# Altium project BMS_Slave.PrjPCB
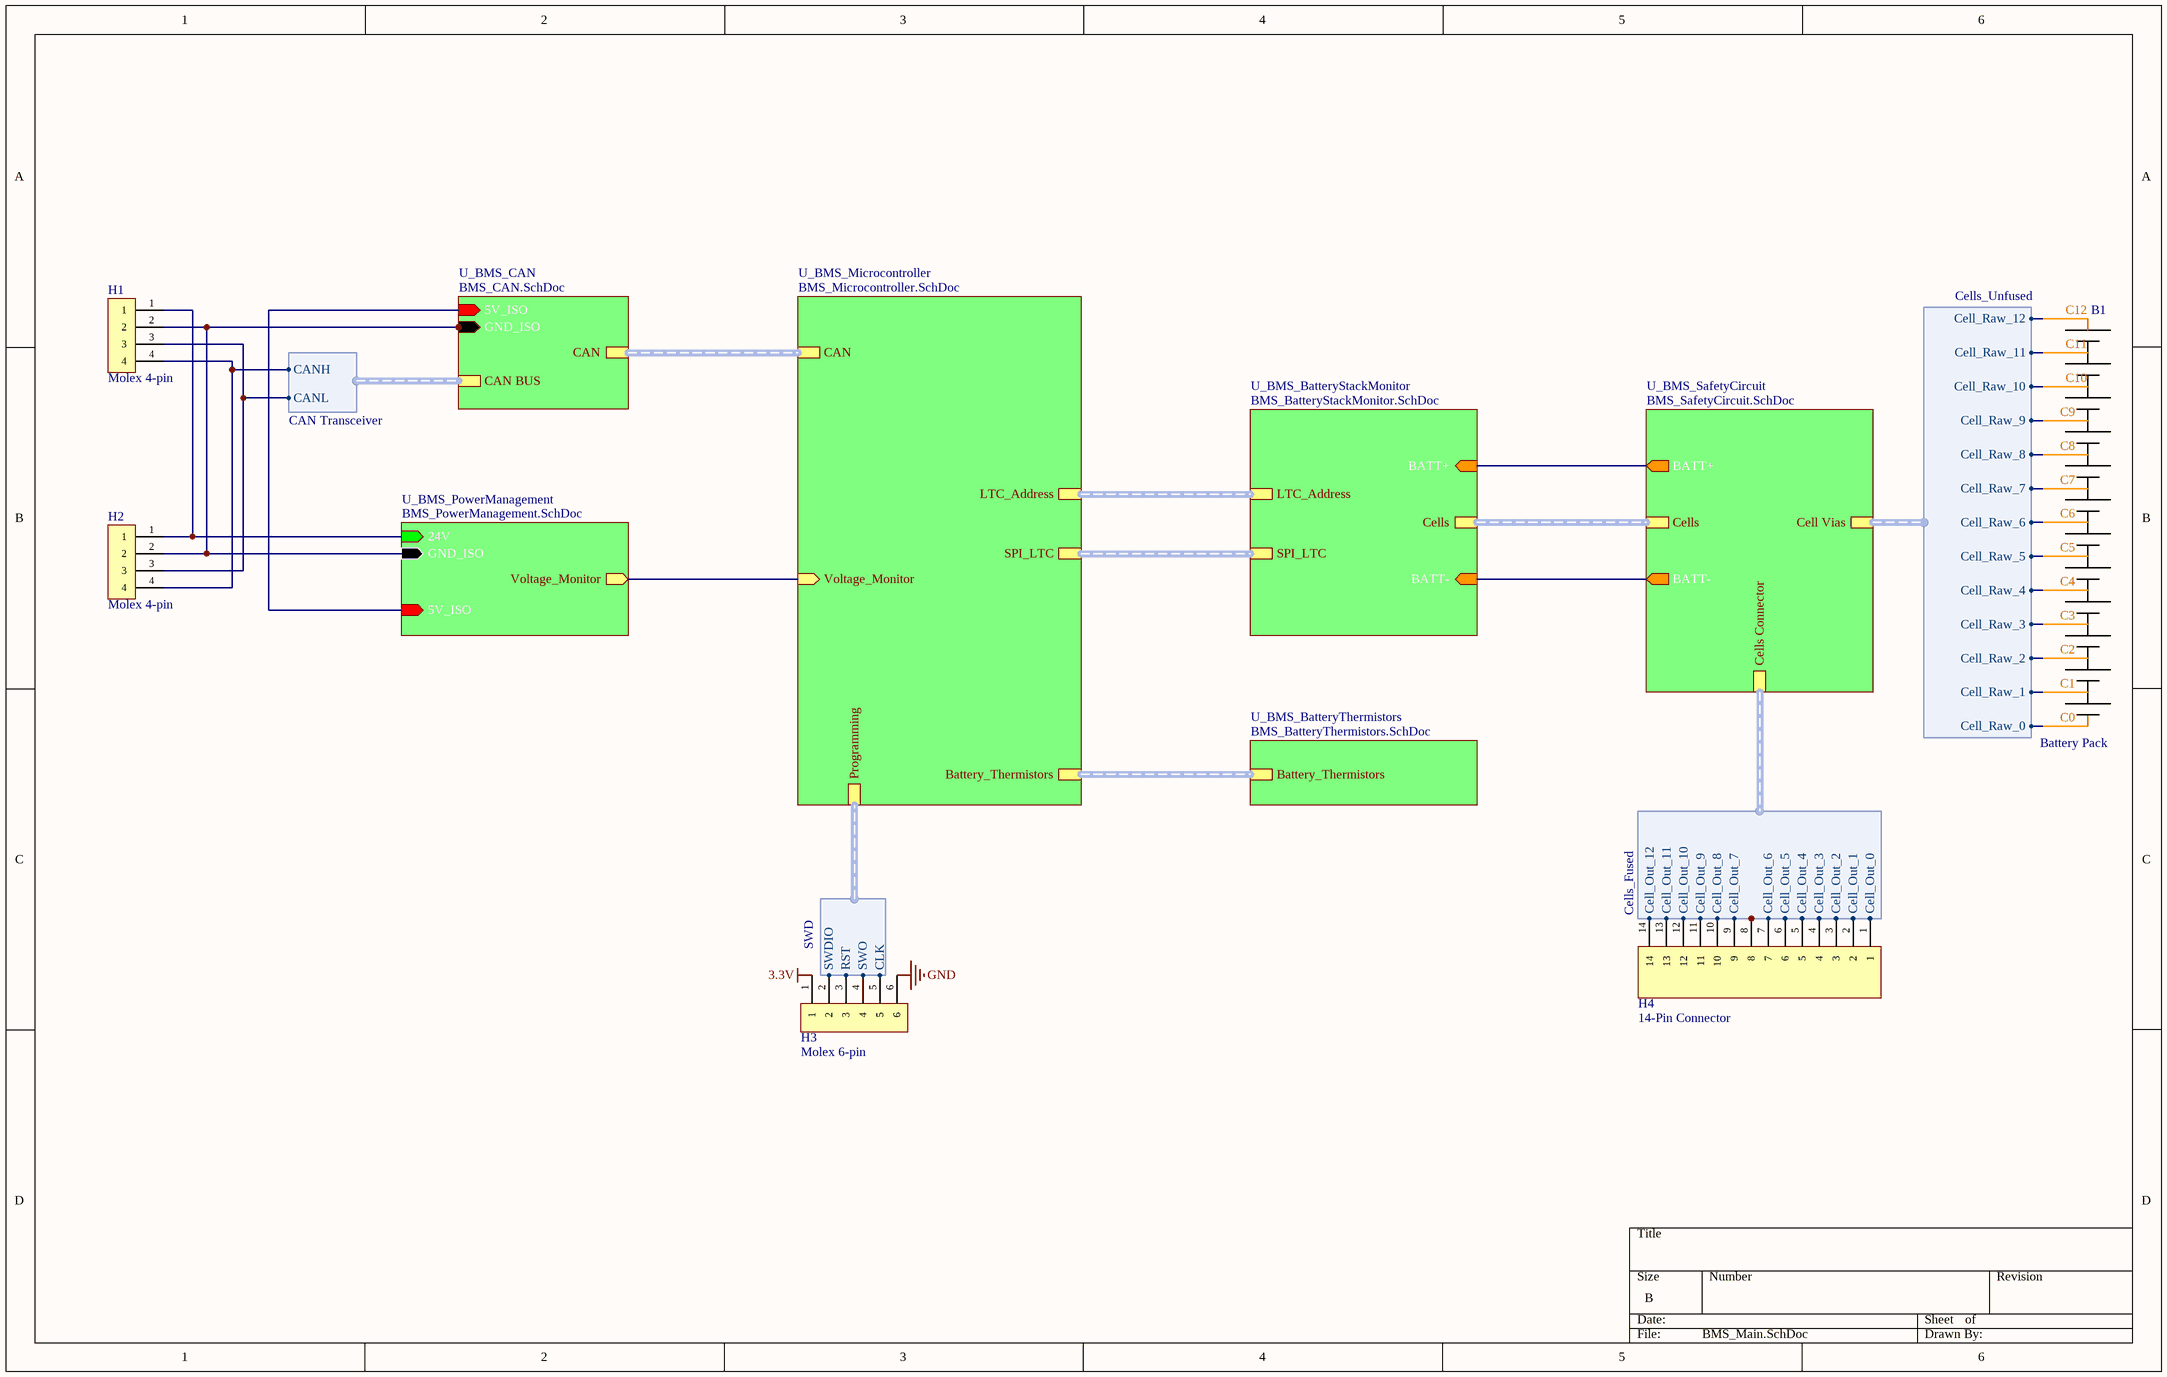
[diagram p0: BMS_Main.SchDoc]
8 sheets, 270 parts. Net scope: hierarchical (ports join the sheet entries above them; power ports are global).
Board file: Slave.PcbDoc
Sheets:
  BMS_Main.SchDoc
    U_BMS_BatteryStackMonitor = BMS_BatteryStackMonitor.SchDoc
      CELL1 = BMS_CellCircuit.SchDoc
      CELL2 = BMS_CellCircuit.SchDoc
      CELL3 = BMS_CellCircuit.SchDoc
      CELL4 = BMS_CellCircuit.SchDoc
      CELL5 = BMS_CellCircuit.SchDoc
      CELL6 = BMS_CellCircuit.SchDoc
      CELL7 = BMS_CellCircuit.SchDoc
      CELL8 = BMS_CellCircuit.SchDoc
      CELL9 = BMS_CellCircuit.SchDoc
      CELL10 = BMS_CellCircuit.SchDoc
      CELL11 = BMS_CellCircuit.SchDoc
      CELL12 = BMS_CellCircuit.SchDoc
    U_BMS_BatteryThermistors = BMS_BatteryThermistors.SchDoc
    U_BMS_Microcontroller = BMS_Microcontroller.SchDoc
    U_BMS_SafetyCircuit = BMS_SafetyCircuit.SchDoc
    U_BMS_CAN = BMS_CAN.SchDoc
    U_BMS_PowerManagement = BMS_PowerManagement.SchDoc

## Sheet BMS_Main.SchDoc
size B

### Parts
B1  Battery Pack  [Cells]
H1  Molex 4-pin  [Communication Connector]
H2  Molex 4-pin  [Communication Connector]
H3  Molex 6-pin  [ProgrammingConnector]
H4  14-Pin Connector  [CellConnector]

### Sub-sheets
U_BMS_BatteryStackMonitor = BMS_BatteryStackMonitor.SchDoc: Cells (harness Harness), BATT+ (in), SPI_LTC (harness SPI), BATT- (in), LTC_Address (harness Address)
U_BMS_BatteryThermistors = BMS_BatteryThermistors.SchDoc: Battery_Thermistors (harness Thermistors)
U_BMS_CAN = BMS_CAN.SchDoc: CAN (harness CAN Controller), CAN BUS (harness CAN Transceiver), GND_ISO (in), 5V_ISO (in)
U_BMS_Microcontroller = BMS_Microcontroller.SchDoc: CAN (harness CAN), Programming (harness SWD), SPI_LTC (harness SPI), Battery_Thermistors (harness Thermistors), LTC_Address (harness Address), Voltage_Monitor (in)
U_BMS_PowerManagement = BMS_PowerManagement.SchDoc: GND_ISO (in), Voltage_Monitor (out), 5V_ISO (in), 24V (in)
U_BMS_SafetyCircuit = BMS_SafetyCircuit.SchDoc: Cell Vias (harness Cells_Unfused), Cells Connector (harness Cells_Fused), Cells (harness Cells Switches), BATT+ (out), BATT- (out)

### Harnesses
CAN Transceiver: CANL, CANH
Cells_Unfused: Cell_Raw_0, Cell_Raw_1, Cell_Raw_2, Cell_Raw_3, Cell_Raw_4, Cell_Raw_5, Cell_Raw_6, Cell_Raw_7, Cell_Raw_8, Cell_Raw_9, Cell_Raw_10, Cell_Raw_11, Cell_Raw_12
Cells_Fused: Cell_Out_0, Cell_Out_1, Cell_Out_2, Cell_Out_3, Cell_Out_4, Cell_Out_5, Cell_Out_6, Cell_Out_7, Cell_Out_8, Cell_Out_9, Cell_Out_10, Cell_Out_11, Cell_Out_12
SWD: SWDIO, SWO, CLK, RST

### Nets
3.3V: H3.1
5V_ISO: sheet U_BMS_CAN/5V_ISO, sheet U_BMS_PowerManagement/5V_ISO
BATT+: sheet U_BMS_BatteryStackMonitor/BATT+, sheet U_BMS_SafetyCircuit/BATT+
GND: H3.6
GND_ISO: H1.2 H2.2 ; sheet U_BMS_CAN/GND_ISO, sheet U_BMS_PowerManagement/GND_ISO
24V: H1.1 H2.1 ; sheet U_BMS_PowerManagement/24V
CF0: H4.1 ; sheet U_BMS_SafetyCircuit/Cells Connector.Cell_Out_0
CF1: H4.2 ; sheet U_BMS_SafetyCircuit/Cells Connector.Cell_Out_1
CF2: H4.3 ; sheet U_BMS_SafetyCircuit/Cells Connector.Cell_Out_2
CF3: H4.4 ; sheet U_BMS_SafetyCircuit/Cells Connector.Cell_Out_3
CF4: H4.5 ; sheet U_BMS_SafetyCircuit/Cells Connector.Cell_Out_4
CF5: H4.6 ; sheet U_BMS_SafetyCircuit/Cells Connector.Cell_Out_5
CF6: H4.7 H4.8 ; sheet U_BMS_SafetyCircuit/Cells Connector.Cell_Out_6
CF7: H4.9 ; sheet U_BMS_SafetyCircuit/Cells Connector.Cell_Out_7
CF8: H4.10 ; sheet U_BMS_SafetyCircuit/Cells Connector.Cell_Out_8
CF9: H4.11 ; sheet U_BMS_SafetyCircuit/Cells Connector.Cell_Out_9
CF10: H4.12 ; sheet U_BMS_SafetyCircuit/Cells Connector.Cell_Out_10
CF11: H4.13 ; sheet U_BMS_SafetyCircuit/Cells Connector.Cell_Out_11
CF12: H4.14 ; sheet U_BMS_SafetyCircuit/Cells Connector.Cell_Out_12
CN1: sheet U_BMS_BatteryStackMonitor/BATT-, sheet U_BMS_SafetyCircuit/BATT-
RESET: H3.3 ; sheet U_BMS_Microcontroller/Programming.RST
SWCLK: H3.5 ; sheet U_BMS_Microcontroller/Programming.CLK
SWDIO: H3.2 ; sheet U_BMS_Microcontroller/Programming.SWDIO
SWO: H3.4 ; sheet U_BMS_Microcontroller/Programming.SWO
Voltage_Monitor: sheet U_BMS_Microcontroller/Voltage_Monitor, sheet U_BMS_PowerManagement/Voltage_Monitor
NetB1_0: B1.0 ; sheet U_BMS_SafetyCircuit/Cell Vias.Cell_Raw_0
NetB1_1: B1.1 ; sheet U_BMS_SafetyCircuit/Cell Vias.Cell_Raw_1
NetB1_2: B1.2 ; sheet U_BMS_SafetyCircuit/Cell Vias.Cell_Raw_2
NetB1_3: B1.3 ; sheet U_BMS_SafetyCircuit/Cell Vias.Cell_Raw_3
NetB1_4: B1.4 ; sheet U_BMS_SafetyCircuit/Cell Vias.Cell_Raw_4
NetB1_5: B1.5 ; sheet U_BMS_SafetyCircuit/Cell Vias.Cell_Raw_5
NetB1_6: B1.6 ; sheet U_BMS_SafetyCircuit/Cell Vias.Cell_Raw_6
NetB1_7: B1.7 ; sheet U_BMS_SafetyCircuit/Cell Vias.Cell_Raw_7
NetB1_8: B1.8 ; sheet U_BMS_SafetyCircuit/Cell Vias.Cell_Raw_8
NetB1_9: B1.9 ; sheet U_BMS_SafetyCircuit/Cell Vias.Cell_Raw_9
NetB1_10: B1.10 ; sheet U_BMS_SafetyCircuit/Cell Vias.Cell_Raw_10
NetB1_11: B1.11 ; sheet U_BMS_SafetyCircuit/Cell Vias.Cell_Raw_11
NetB1_12: B1.12 ; sheet U_BMS_SafetyCircuit/Cell Vias.Cell_Raw_12
NetChoke500_2: H1.4 H2.4 ; sheet U_BMS_CAN/CAN BUS.CANH
NetChoke500_3: H1.3 H2.3 ; sheet U_BMS_CAN/CAN BUS.CANL

### Buses and harness runs
harness sheet U_BMS_BatteryStackMonitor/Cells = sheet U_BMS_SafetyCircuit/Cells
harness sheet U_BMS_BatteryStackMonitor/LTC_Address = sheet U_BMS_Microcontroller/LTC_Address
harness sheet U_BMS_BatteryStackMonitor/SPI_LTC = sheet U_BMS_Microcontroller/SPI_LTC
harness sheet U_BMS_BatteryThermistors/Battery_Thermistors = sheet U_BMS_Microcontroller/Battery_Thermistors
harness sheet U_BMS_CAN/CAN = sheet U_BMS_Microcontroller/CAN

### Notes on the sheet
- (in symbol Battery Pack) C12; C11; C10; C9; C8; C7; C6; C5; C4; C3; C2; C1; C0

### Library data of the parts
B1 = Battery Pack: 12s3p battery pack, LiFePO4 GH Battery Cell with 3.7V and 8Ah
H1 H2 = Molex 4-pin: Micro-Fit 3.0 Vertical Header, 3.00mm Pitch, Dual Row, 4 Circuits, with Solder Tab, Tin, Glow-Wire Capable, Black + Micro-Fit 3.0 Receptacle Housing, Dual Row, 4 Circuits, UL 94V-0, Low-Halogen, Black
H3 = Molex 6-pin: Micro-Fit 3.0 Vertical Header, 3.00mm Pitch, Dual Row, 6 Circuits, with Solder Tab, Tin, Glow-Wire Capable, Black + Micro-Fit 3.0 Receptacle Housing, Dual Row, 6 Circuits, UL 94V-0, Low-Halogen, Black
H4 = 14-Pin Connector: Micro-Fit 3.0 Right-Angle Header, 3.00mm Pitch, Dual Row, 14 Circuits, with Solder Tab, Tin, Glow-Wire Capable, Black + Micro-Fit 3.0 Receptacle Housing, Dual Row, 14 Circuits, UL 94V-0, Low-Halogen, Black

## Sheet BMS_BatteryStackMonitor.SchDoc
size A
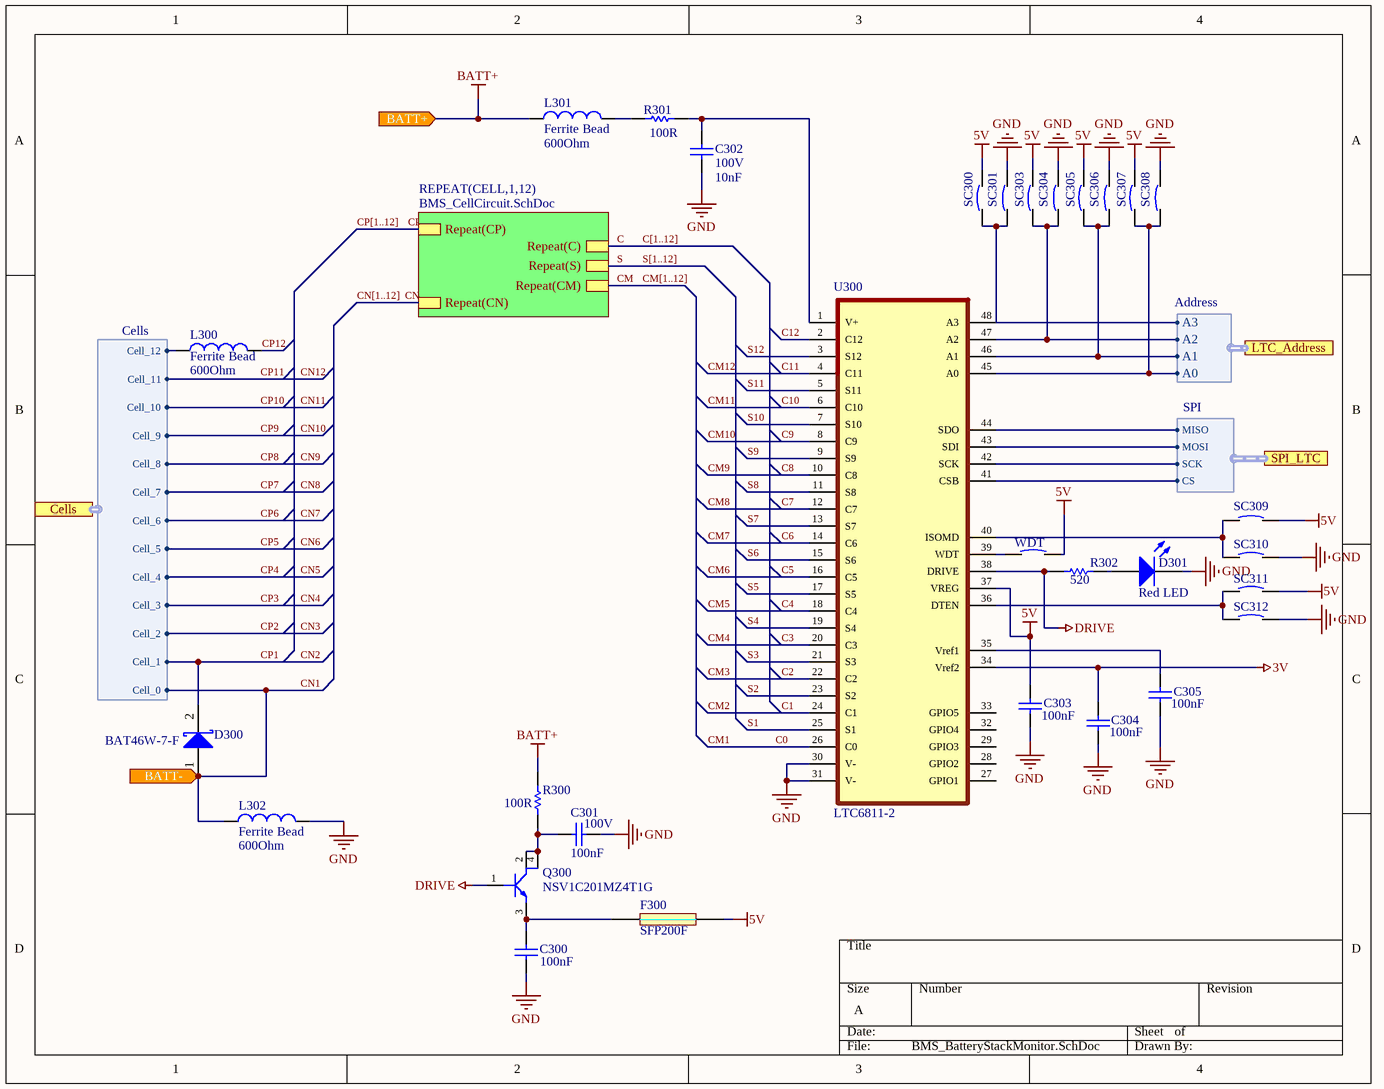
[diagram p1: BMS_BatteryStackMonitor.SchDoc]

### Parts
C300  value 100nF  [CAPC2012X14N]  (hidden comment: 100V)
C301  100V  value 100nF  [CAPC2012X14N]
C302  100V  value 10nF  [CAPC2012X14N]
C303  value 100nF  [CAPC2012X14N]  (hidden comment: 100V)
C304  value 100nF  [CAPC2012X14N]  (hidden comment: 100V)
C305  value 100nF  [CAPC2012X14N]  (hidden comment: 100V)
D300  BAT46W-7-F  [SODFL370X135-2N]
D301  Red LED  [SMD RED LED]
F300  SFP200F  [DIOC3216X12N]
L300  Ferrite Bead  value 600Ohm  [INDC3216X13N]
L301  Ferrite Bead  value 600Ohm  [INDC3216X13N]
L302  Ferrite Bead  value 600Ohm  [INDC3216X13N]
Q300  NSV1C201MZ4T1G  [SOT230P700X180-4N]
R300  value 100R  [RESC2012X07N]  (hidden comment: R0805)
R301  value 100R  [RESC2012X07N]  (hidden comment: R0805)
R302  value 520  [RESC2012X07N]  (hidden comment: R0805)
SC300  Short Circuit  [RESC2012X07N]  (value not drawn)
SC301  Short Circuit  [RESC2012X07N]  (value not drawn)
SC303  Short Circuit  [RESC2012X07N]  (value not drawn)
SC304  Short Circuit  [RESC2012X07N]  (value not drawn)
SC305  Short Circuit  [RESC2012X07N]  (value not drawn)
SC306  Short Circuit  [RESC2012X07N]  (value not drawn)
SC307  Short Circuit  [RESC2012X07N]  (value not drawn)
SC308  Short Circuit  [RESC2012X07N]  (value not drawn)
SC309  Short Circuit  [RESC2012X07N]  (value not drawn)
SC310  Short Circuit  [RESC2012X07N]  (value not drawn)
SC311  Short Circuit  [RESC2012X07N]  (value not drawn)
SC312  Short Circuit  [RESC2012X07N]  (value not drawn)
U300  LTC6811-2  [SSOP50P780X200-48N]
WDT  Short Circuit  [RESC2012X07N]  (value not drawn)

### Sub-sheets
REPEAT(CELL,1,12) = BMS_CellCircuit.SchDoc: Repeat(CP), Repeat(CN), Repeat(C), Repeat(CM), Repeat(S)

### Ports
BATT+ (in), BATT- (in), Cells (harness Cells), LTC_Address (harness Address), SPI_LTC (harness SPI)

### Harnesses
Cells: Cell_0, Cell_1, Cell_2, Cell_3, Cell_4, Cell_5, Cell_6, Cell_7, Cell_8, Cell_9, Cell_10, Cell_11, Cell_12
SPI: MISO, MOSI, SCK, CS
Address: A3, A2, A1, A0

### Nets
3V: C304.1 U300.34(Vref2)
5V: C303.1 F300.2 SC300.2 SC303.2 SC305.2 SC307.2 SC309.2 SC311.2 U300.37(VREG) WDT.2
BATT+: L300.1 L301.1 R300.1 ; port BATT+, port Cells.Cell_12
DRIVE: Q300.1 R302.2 U300.38(DRIVE)
GND: C300.2 C301.2 C302.2 C303.2 C304.2 C305.2 D301.2(K) L302.2 SC301.2 SC304.2 SC306.2 SC308.2 SC310.2 SC312.2 U300.30(V-) U300.31(V-)
C: sheet REPEAT(CELL,1,12)/Repeat(C)
C0: U300.26(C0)  [also labelled CM1]
C1: U300.24(C1)  [also labelled CM2]
C2: U300.22(C2)  [also labelled CM3]
C3: U300.20(C3)  [also labelled CM4]
C4: U300.18(C4)  [also labelled CM5]
C5: U300.16(C5)  [also labelled CM6]
C6: U300.14(C6)  [also labelled CM7]
C7: U300.12(C7)  [also labelled CM8]
C8: U300.10(C8)  [also labelled CM9]
C9: U300.8(C9)  [also labelled CM10]
C10: U300.6(C10)  [also labelled CM11]
C11: U300.4(C11)  [also labelled CM12]
C12: U300.2(C12)
CM: sheet REPEAT(CELL,1,12)/Repeat(CM)
CN: sheet REPEAT(CELL,1,12)/Repeat(CN)
CN1: D300.1(A) L302.1 ; port BATT-, port Cells.Cell_0
CN2: D300.2(K) ; port Cells.Cell_1  [also labelled CP1]
CP: sheet REPEAT(CELL,1,12)/Repeat(CP)
CP12: L300.2
S: sheet REPEAT(CELL,1,12)/Repeat(S)
S1: U300.25(S1)
S2: U300.23(S2)
S3: U300.21(S3)
S4: U300.19(S4)
S5: U300.17(S5)
S6: U300.15(S6)
S7: U300.13(S7)
S8: U300.11(S8)
S9: U300.9(S9)
S10: U300.7(S10)
S11: U300.5(S11)
S12: U300.3(S12)
SPI1_CS: U300.41(CSB) ; port SPI_LTC.CS
SPI1_MISO: U300.44(SDO) ; port SPI_LTC.MISO
SPI1_MOSI: U300.43(SDI) ; port SPI_LTC.MOSI
SPI1_SCK: U300.42(SCK) ; port SPI_LTC.SCK
Α0: SC307.1 SC308.1 U300.45(A0) ; port LTC_Address.A0
Α1: SC305.1 SC306.1 U300.46(A1) ; port LTC_Address.A1
Α2: SC303.1 SC304.1 U300.47(A2) ; port LTC_Address.A2
Α3: SC300.1 SC301.1 U300.48(A3) ; port LTC_Address.A3
NetC300_1: C300.1 F300.1 Q300.3
NetC301_1: C301.1 Q300.2 Q300.4 R300.2
NetC302_1: C302.1 R301.1 U300.1(V+)
NetC305_1: C305.1 U300.35(Vref1)
NetD301_1: D301.1(A) R302.1
NetL301_2: L301.2 R301.2
NetSC309_1: SC309.1 SC310.1 U300.40(ISOMD)
NetSC311_1: SC311.1 SC312.1 U300.36(DTEN)
NetU300_39: U300.39(WDT) WDT.1

Not connected (* = marked no-connect by the designer): U300 27(GPIO1) 28(GPIO2) 29(GPIO3) 32(GPIO4) 33(GPIO5)

### Buses and harness runs
bus C[1..12]
bus CM[1..12]
bus CN[1..12]
bus CP[1..12]
bus S[1..12]

### Library data of the parts
C300-C305 = Cap: Capacitor; Published: 8-Jun-2000; LatestRevisionDate: 17-Jul-2002; LatestRevisionNote: Re-released for DXP Platform.; PackageReference: RAD-0.3; Publisher: Altium Limited; PackageDescription: Radial Cap, Thru-Hole; 2 Leads; 0.3 in Pin Spacing
D300 = Diode BAT17: Silicon RF Schottky Diode for Mixer Applications in the VHF/UHF Range; Note: Pin 2 is not connected and not drawn.; Published: 21-Mar-2003; LatestRevisionDate: 29-May-2009; LatestRevisionNote: IPC-7351 Footprint Added.; DatasheetVersion: Oct-1999; PackageVersion: Sep-2001; PackageReference: SOT-23; Publisher: Altium Limited; PackageDescription: 3-Pin SOT-23 Package 0.95 mm Pitch, 2.5 mm Lead Span; ComponentLink1Description: Manufacturer Link; ComponentLink1URL: http://www.infineon.com/; ComponentLink2Description: Datasheet; ComponentLink2URL: http://www.infineon.com/upload/Document/cmc_upload/documents/009/363/bat17series.pdf
D301 = LED0: Typical INFRARED GaAs LED; Published: 8-Jun-2000; LatestRevisionDate: 08-Jul-2005; LatestRevisionNote: Mech Layer 1 removed.; PackageReference: LED-0; Publisher: Altium Limited; PackageDescription: LED; 2 Leads
F300 = SFP200F: Surface Mount Fuses VERY FAST GLASS CER 63V 2A SZ 1206
L300 L302 = Inductor: Code_IEC: 1005; Published: 8-Jun-2000; LatestRevisionDate: 29-May-2009; LatestRevisionNote: IPC-7351 Footprint Added.; PackageReference: 0402-A; Publisher: Altium Limited; PackageDescription: Chip Inductor; Code_JEITA: 0402
L301 = Inductor: Inductor Coil - Ferrite Bead; Code_IEC: 1005; Published: 8-Jun-2000; LatestRevisionDate: 29-May-2009; LatestRevisionNote: IPC-7351 Footprint Added.; PackageReference: 0402-A; Publisher: Altium Limited; PackageDescription: Chip Inductor; Code_JEITA: 0402
Q300 = NSV1C201MZ4T1G: 100V, 2.0A, LOW Vce(sat), NPN Transistor
R300-R302 = Res1: Resistor; Published: 8-Jun-2000; LatestRevisionDate: 17-Jul-2002; LatestRevisionNote: Re-released for DXP Platform.; PackageReference: AXIAL-0.3; Publisher: Altium Limited; PackageDescription: Axial Device, Thru-Hole; 2 Leads; 0.3 in Pin Spacing
U300 = LTC6811-2: LTC6811-2, Multicell Battery Monitor, 48-Lead SSOP Package

## Sheet BMS_CellCircuit.SchDoc
size A
Used 12 times, as channels U_BMS_BatteryStackMonitor/CELL1, U_BMS_BatteryStackMonitor/CELL2, U_BMS_BatteryStackMonitor/CELL3, U_BMS_BatteryStackMonitor/CELL4, U_BMS_BatteryStackMonitor/CELL5, U_BMS_BatteryStackMonitor/CELL6, U_BMS_BatteryStackMonitor/CELL7, U_BMS_BatteryStackMonitor/CELL8, U_BMS_BatteryStackMonitor/CELL9, U_BMS_BatteryStackMonitor/CELL10, U_BMS_BatteryStackMonitor/CELL11, U_BMS_BatteryStackMonitor/CELL12. Parts and nets are listed once, with the designators drawn on the sheet.
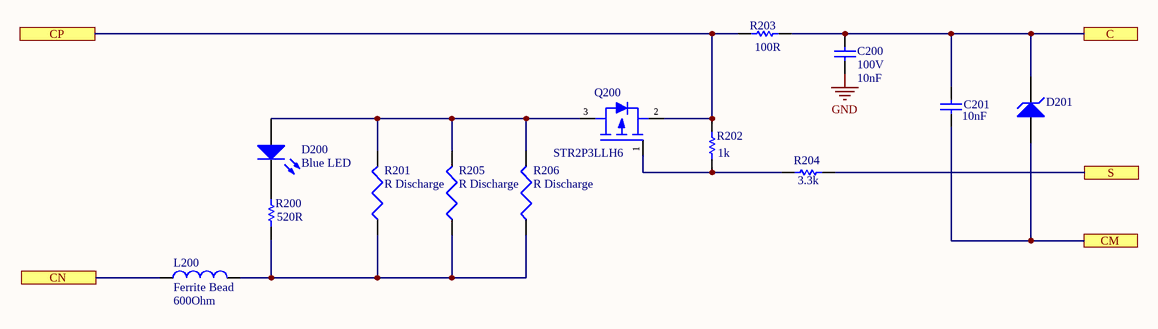
[diagram p2: BMS_CellCircuit.SchDoc]

### Parts
C200  100V  value 10nF  [CAPC2012X14N]
C201  value 10nF  [CAPC2012X14N]  (hidden comment: C0805)
D200  Blue LED  [SMD Blue LED]
D201  D Zener 6.8V  [SODFL250X110-2N]  (value not drawn)
L200  Ferrite Bead  value 600Ohm  [INDC3216X13N]
Q200  STR2P3LLH6  [SOT95P280X110-3N]
R200  value 520R  [RESC2012X07N]  (hidden comment: R0805)
R201  R Discharge  [RESC1632X06N]
R202  value 1k  [RESC2012X07N]  (hidden comment: R0805)
R203  value 100R  [RESC2012X07N]  (hidden comment: R0805)
R204  value 3.3k  [RESC2012X07N]  (hidden comment: R0805)
R205  R Discharge  [RESC1632X06N]
R206  R Discharge  [RESC1632X06N]

### Ports
C, CM, CN, CP, S

### Nets
GND: C200.2
C: C200.1 C201.1 D201.2(K) R203.1 ; port C
CM: C201.2 D201.1(A) ; port CM
CN: L200.1 ; port CN
CP: Q200.2 R202.2 R203.2 ; port CP
S: R204.1 ; port S
NetD200_1: D200.1(A) Q200.3 R201.2 R205.2 R206.2
NetD200_2: D200.2(K) R200.2
NetL200_2: L200.2 R200.1 R201.1 R205.1 R206.1
NetQ200_1: Q200.1 R202.1 R204.2

### Channels
U_BMS_BatteryStackMonitor/CELL1: designators end in _CELL1; ports C=C1 CM=C0 CN=CN1 CP=CN2 S=S1
U_BMS_BatteryStackMonitor/CELL2: designators end in _CELL2; ports C=C2 CM=C1 CN=CN2 CP=CN3 S=S2
U_BMS_BatteryStackMonitor/CELL3: designators end in _CELL3; ports C=C3 CM=C2 CN=CN3 CP=CN4 S=S3
U_BMS_BatteryStackMonitor/CELL4: designators end in _CELL4; ports C=C4 CM=C3 CN=CN4 CP=CN5 S=S4
U_BMS_BatteryStackMonitor/CELL5: designators end in _CELL5; ports C=C5 CM=C4 CN=CN5 CP=CN6 S=S5
U_BMS_BatteryStackMonitor/CELL6: designators end in _CELL6; ports C=C6 CM=C5 CN=CN6 CP=CN7 S=S6
U_BMS_BatteryStackMonitor/CELL7: designators end in _CELL7; ports C=C7 CM=C6 CN=CN7 CP=CN8 S=S7
U_BMS_BatteryStackMonitor/CELL8: designators end in _CELL8; ports C=C8 CM=C7 CN=CN8 CP=CN9 S=S8
U_BMS_BatteryStackMonitor/CELL9: designators end in _CELL9; ports C=C9 CM=C8 CN=CN9 CP=CN10 S=S9
U_BMS_BatteryStackMonitor/CELL10: designators end in _CELL10; ports C=C10 CM=C9 CN=CN10 CP=CN11 S=S10
U_BMS_BatteryStackMonitor/CELL11: designators end in _CELL11; ports C=C11 CM=C10 CN=CN11 CP=CN12 S=S11
U_BMS_BatteryStackMonitor/CELL12: designators end in _CELL12; ports C=C12 CM=C11 CN=CN12 CP=CP12 S=S12

### Library data of the parts
C200 C201 = Cap: Capacitor; Published: 8-Jun-2000; LatestRevisionDate: 17-Jul-2002; LatestRevisionNote: Re-released for DXP Platform.; PackageReference: RAD-0.3; Publisher: Altium Limited; PackageDescription: Radial Cap, Thru-Hole; 2 Leads; 0.3 in Pin Spacing
D200 = LED0: Typical INFRARED GaAs LED; Published: 8-Jun-2000; LatestRevisionDate: 08-Jul-2005; LatestRevisionNote: Mech Layer 1 removed.; PackageReference: LED-0; Publisher: Altium Limited; PackageDescription: LED; 2 Leads
D201 = D Zener: Zener Diodes PDZ6.8B/SOD2/REEL 13" Q1/T1 *S; Published: 8-Jun-2000; LatestRevisionDate: 17-Jul-2002; LatestRevisionNote: Re-released for DXP Platform.; PackageReference: DIODE-0.7; Publisher: Altium Limited; PackageDescription: Diode, Thru-Hole; 2 Leads; 0.7 in Pin Spacing
L200 = Inductor: Code_IEC: 1005; Published: 8-Jun-2000; LatestRevisionDate: 29-May-2009; LatestRevisionNote: IPC-7351 Footprint Added.; PackageReference: 0402-A; Publisher: Altium Limited; PackageDescription: Chip Inductor; Code_JEITA: 0402
Q200 = STR2P3LLH6: P-channel -30 V, 48 mΩ typICAL, -2 A STripFET™ H6 Power MOSFET in a SOT-23 package.
R200 R202-R204 = Res1: Resistor; Published: 8-Jun-2000; LatestRevisionDate: 17-Jul-2002; LatestRevisionNote: Re-released for DXP Platform.; PackageReference: AXIAL-0.3; Publisher: Altium Limited; PackageDescription: Axial Device, Thru-Hole; 2 Leads; 0.3 in Pin Spacing
R201 R205 R206 = R Discharge: 0612 Discharge Resistance - WK73R2BTTD42R2F

## Sheet BMS_BatteryThermistors.SchDoc
size A
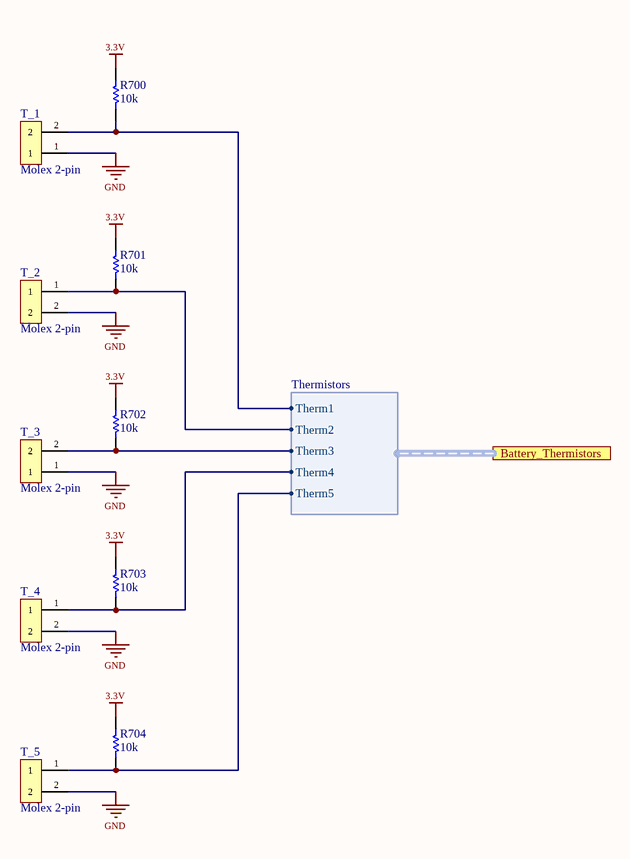
[diagram p3: BMS_BatteryThermistors.SchDoc]

### Parts
R700  value 10k  [RESC2012X07N]  (hidden comment: R0805)
R701  value 10k  [RESC2012X07N]  (hidden comment: R0805)
R702  value 10k  [RESC2012X07N]  (hidden comment: R0805)
R703  value 10k  [RESC2012X07N]  (hidden comment: R0805)
R704  value 10k  [RESC2012X07N]  (hidden comment: R0805)
T_1  Molex 2-pin  [ThermistorConnector]
T_2  Molex 2-pin  [ThermistorConnector]
T_3  Molex 2-pin  [ThermistorConnector]
T_4  Molex 2-pin  [ThermistorConnector]
T_5  Molex 2-pin  [ThermistorConnector]

### Ports
Battery_Thermistors (harness Thermistors)

### Harnesses
Thermistors: Therm5, Therm4, Therm3, Therm2, Therm1

### Nets
3.3V: R700.2 R701.2 R702.2 R703.2 R704.2
GND: T_1.1 T_2.2 T_3.1 T_4.2 T_5.2
Batt_Therm_1: R700.1 T_1.2 ; port Battery_Thermistors.Therm1
Batt_Therm_2: R701.1 T_2.1 ; port Battery_Thermistors.Therm2
Batt_Therm_3: R702.1 T_3.2 ; port Battery_Thermistors.Therm3
Batt_Therm_4: R703.1 T_4.1 ; port Battery_Thermistors.Therm4
Batt_Therm_5: R704.1 T_5.1 ; port Battery_Thermistors.Therm5

### Library data of the parts
R700-R704 = Res1: Resistor; Published: 8-Jun-2000; LatestRevisionDate: 17-Jul-2002; LatestRevisionNote: Re-released for DXP Platform.; PackageReference: AXIAL-0.3; Publisher: Altium Limited; PackageDescription: Axial Device, Thru-Hole; 2 Leads; 0.3 in Pin Spacing
T_1-T_5 = Molex 2-pin: 2.54mm Pitch SL Wire-to-Board Header, Low Profile, Surface Mount, Single Row, Right-Angle, 3.05mm Pocket, Shrouded, with Press-fit Plastic Peg, 2 Circuits, Tin (Sn) Plating + SL Crimp Housing, Single Row, Version G, Positive Latch, 2 Circuits, Black

## Sheet BMS_Microcontroller.SchDoc
size A
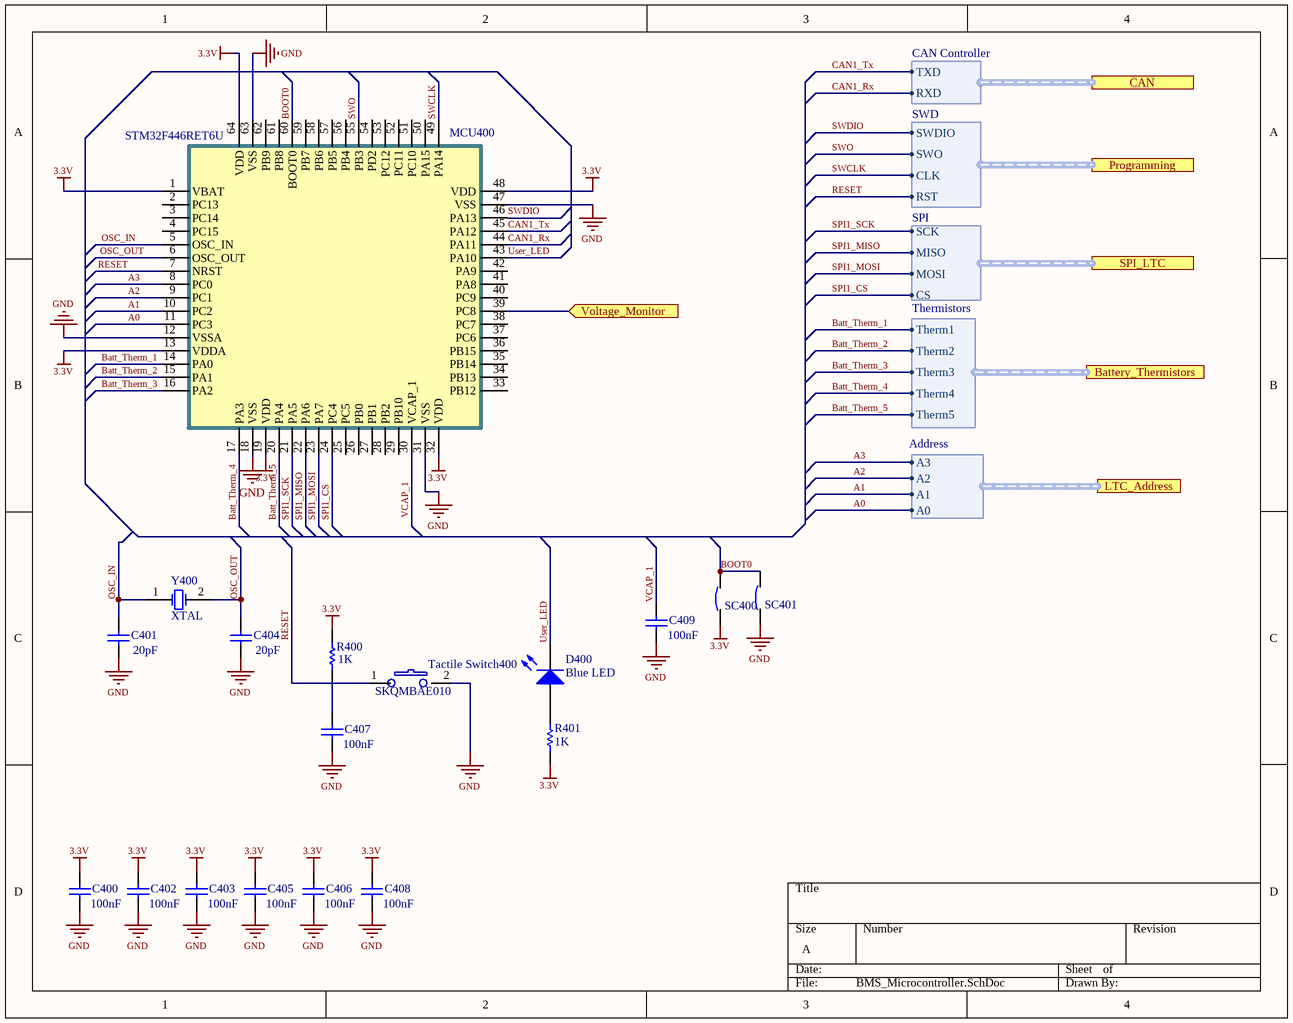
[diagram p4: BMS_Microcontroller.SchDoc]

### Parts
C400  value 100nF  [CAPC2012X14N]  (hidden comment: Cap)
C401  value 20pF  [CAPC2012X14N]  (hidden comment: Cap)
C402  value 100nF  [CAPC2012X14N]  (hidden comment: Cap)
C403  value 100nF  [CAPC2012X14N]  (hidden comment: Cap)
C404  value 20pF  [CAPC2012X14N]  (hidden comment: Cap)
C405  value 100nF  [CAPC2012X14N]  (hidden comment: Cap)
C406  value 100nF  [CAPC2012X14N]  (hidden comment: Cap)
C407  value 100nF  [CAPC2012X14N]  (hidden comment: Cap)
C408  value 100nF  [CAPC2012X14N]  (hidden comment: Cap)
C409  value 100nF  [CAPC2012X14N]  (hidden comment: Cap)
D400  Blue LED  [SMD Blue LED]
MCU400  STM32F446RET6U  [LQFP50P1200X1200X160-64N]
R400  value 1K  [RESC2012X07N]  (hidden comment: Res1)
R401  value 1K  [RESC2012X07N]  (hidden comment: Res1)
SC400  Short Circuit  [RESC2012X07N]  (value not drawn)
SC401  Short Circuit  [RESC2012X07N]  (value not drawn)
Tactile_Switch400  SKQMBAE010  [SKTHBAE010]
Y400  XTAL  [FOXSDLF/080-20]

### Ports
Battery_Thermistors (harness Thermistors), CAN (harness CAN Controller), LTC_Address (harness Address), Programming (harness SWD), SPI_LTC (harness SPI), Voltage_Monitor (in)

### Harnesses
CAN Controller: RXD, TXD
SWD: RST, CLK, SWO, SWDIO
SPI: CS, MISO, SCK, MOSI
Address: A3, A2, A1, A0
Thermistors: Therm1, Therm2, Therm4, Therm5, Therm3

### Nets
3.3V: C400.1 C402.1 C403.1 C405.1 C406.1 C408.1 MCU400.1(VBAT) MCU400.13(VDDA) MCU400.19(VDD) MCU400.32(VDD) MCU400.48(VDD) MCU400.64(VDD) R400.2 R401.2 SC400.1
GND: C400.2 C401.2 C402.2 C403.2 C404.2 C405.2 C406.2 C407.2 C408.2 C409.2 MCU400.12(VSSA) MCU400.18(VSS) MCU400.31(VSS) MCU400.47(VSS) MCU400.63(VSS) SC401.1 Tactile_Switch400.2
Batt_Therm_1: MCU400.14(PA0) ; port Battery_Thermistors.Therm1
Batt_Therm_2: MCU400.15(PA1) ; port Battery_Thermistors.Therm2
Batt_Therm_3: MCU400.16(PA2) ; port Battery_Thermistors.Therm3
Batt_Therm_4: MCU400.17(PA3) ; port Battery_Thermistors.Therm4
Batt_Therm_5: MCU400.20(PA4) ; port Battery_Thermistors.Therm5
BOOT0: MCU400.60(BOOT0) SC400.2 SC401.2
CAN1_Rx: MCU400.44(PA11) ; port CAN.RXD
CAN1_Tx: MCU400.45(PA12) ; port CAN.TXD
OSC_IN: C401.1 MCU400.5(OSC_IN) Y400.1(OSC1)
OSC_OUT: C404.1 MCU400.6(OSC_OUT) Y400.2(OSC2)
RESET: C407.1 MCU400.7(NRST) R400.1 Tactile_Switch400.1 ; port Programming.RST
SPI1_CS: MCU400.24(PC4) ; port SPI_LTC.CS
SPI1_MISO: MCU400.22(PA6) ; port SPI_LTC.MISO
SPI1_MOSI: MCU400.23(PA7) ; port SPI_LTC.MOSI
SPI1_SCK: MCU400.21(PA5) ; port SPI_LTC.SCK
SWCLK: MCU400.49(PA14) ; port Programming.CLK
SWDIO: MCU400.46(PA13) ; port Programming.SWDIO
SWO: MCU400.55(PB3) ; port Programming.SWO
User_LED: D400.2(K) MCU400.43(PA10)
VCAP_1: C409.1 MCU400.30(VCAP_1)
Voltage_Monitor: MCU400.39(PC8) ; port Voltage_Monitor
Α0: MCU400.11(PC3) ; port LTC_Address.A0
Α1: MCU400.10(PC2) ; port LTC_Address.A1
Α2: MCU400.9(PC1) ; port LTC_Address.A2
Α3: MCU400.8(PC0) ; port LTC_Address.A3
NetD400_1: D400.1(A) R401.1

Not connected (* = marked no-connect by the designer): MCU400 2(PC13) 3(PC14) 4(PC15) 25(PC5) 26(PB0) 27(PB1) 28(PB2) 29(PB10) 33(PB12) 34(PB13) 35(PB14) 36(PB15) 37(PC6) 38(PC7) 40(PC9) 41(PA8) 42(PA9) 50(PA15) 51(PC10) 52(PC11) 53(PC12) 54(PD2) 56(PB4) 57(PB5) 58(PB6) 59(PB7) 61(PB8) 62(PB9)

### Library data of the parts
C400-C409 = Cap: Capacitor; Published: 8-Jun-2000; LatestRevisionDate: 17-Jul-2002; LatestRevisionNote: Re-released for DXP Platform.; PackageReference: RAD-0.3; Publisher: Altium Limited; PackageDescription: Radial Cap, Thru-Hole; 2 Leads; 0.3 in Pin Spacing
D400 = LED0: Typical INFRARED GaAs LED; Published: 8-Jun-2000; LatestRevisionDate: 08-Jul-2005; LatestRevisionNote: Mech Layer 1 removed.; PackageReference: LED-0; Publisher: Altium Limited; PackageDescription: LED; 2 Leads
MCU400 = STM32F446RET6U: ARM® Cortex®-M4 32b MCU+FPU, 225DMIPS, up to 512kB Flash/128+4KB RAM, USB OTG HS/FS, 17 TIMs, 3 ADCs, 20 comm. interfaces
R400 R401 = Res1: Resistor; Published: 8-Jun-2000; LatestRevisionDate: 17-Jul-2002; LatestRevisionNote: Re-released for DXP Platform.; PackageReference: AXIAL-0.3; Publisher: Altium Limited; PackageDescription: Axial Device, Thru-Hole; 2 Leads; 0.3 in Pin Spacing
Tactile_Switch400 = SKQMBAE010: ALPS 6.0x3.5x4.3mm SMD Tactile Switch, Ratings 50mA/12VDC
Y400 = XTAL: Crystal Oscillator; Published: 8-Jun-2000; LatestRevisionDate: 17-Jul-2002; LatestRevisionNote: Re-released for DXP Platform.; PackageReference: R38; Publisher: Altium Limited; PackageDescription: Crystal, Thru-Hole; 2 Leads; Body 3.1 x 8.2 mm (Dia.xH)

## Sheet BMS_SafetyCircuit.SchDoc
size A
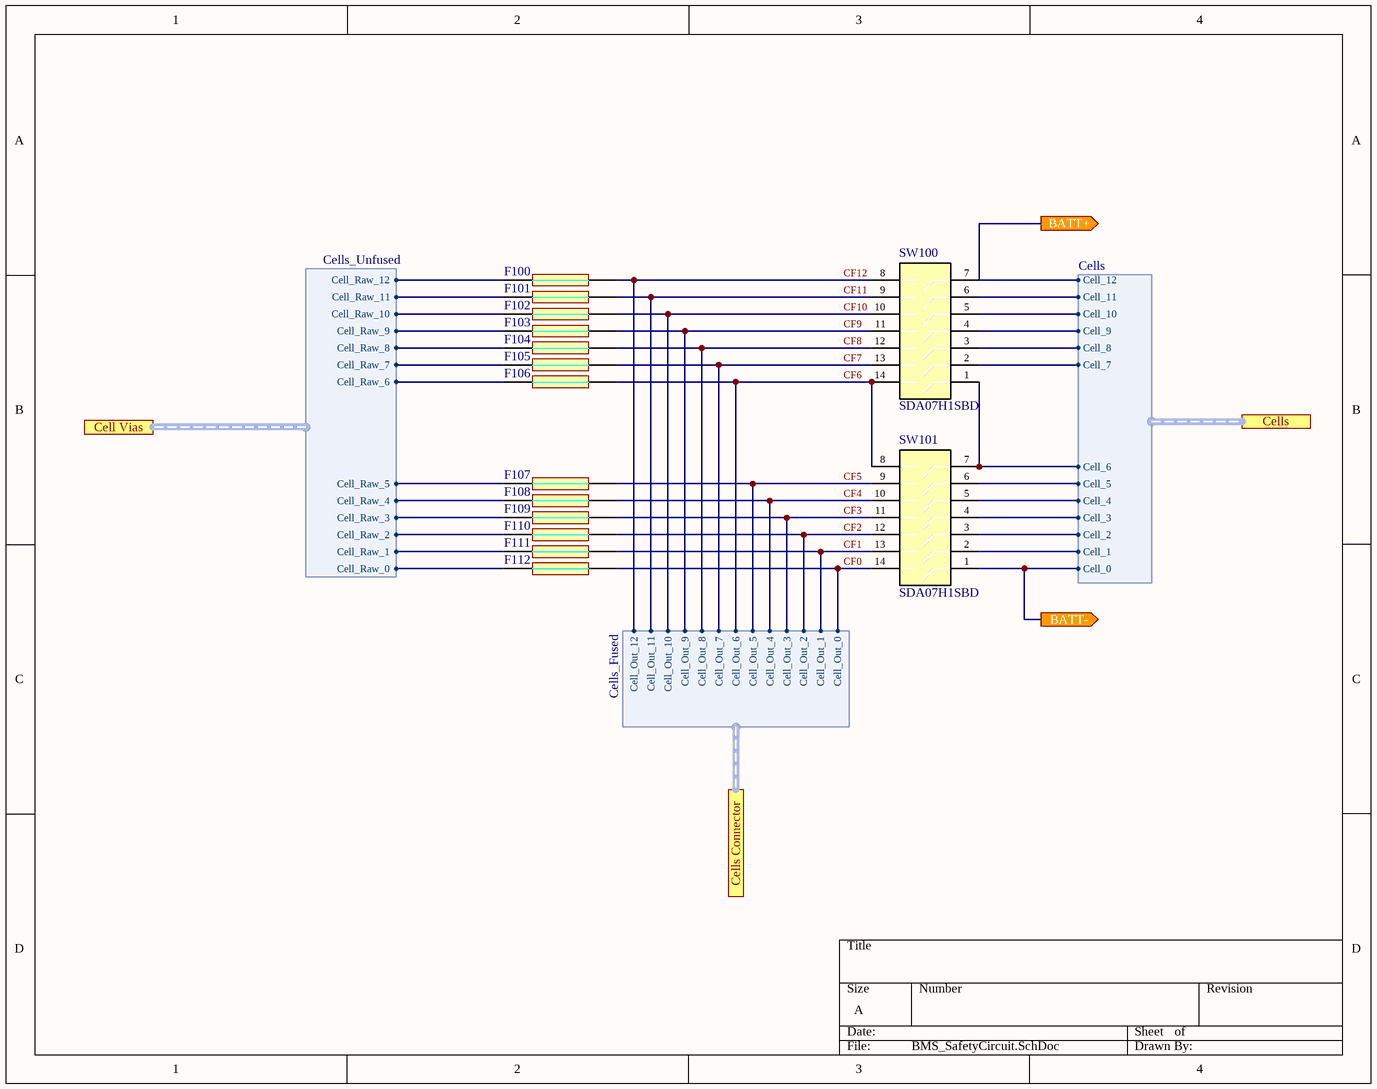
[diagram p5: BMS_SafetyCircuit.SchDoc]

### Parts
F100  SFP200F  [DIOC3216X12N]  (value not drawn)
F101  SFP200F  [DIOC3216X12N]  (value not drawn)
F102  SFP200F  [DIOC3216X12N]  (value not drawn)
F103  SFP200F  [DIOC3216X12N]  (value not drawn)
F104  SFP200F  [DIOC3216X12N]  (value not drawn)
F105  SFP200F  [DIOC3216X12N]  (value not drawn)
F106  SFP200F  [DIOC3216X12N]  (value not drawn)
F107  SFP200F  [DIOC3216X12N]  (value not drawn)
F108  SFP200F  [DIOC3216X12N]  (value not drawn)
F109  SFP200F  [DIOC3216X12N]  (value not drawn)
F110  SFP200F  [DIOC3216X12N]  (value not drawn)
F111  SFP200F  [DIOC3216X12N]  (value not drawn)
F112  SFP200F  [DIOC3216X12N]  (value not drawn)
SW100  SDA07H1SBD  [7 pos Dip-Switch]
SW101  SDA07H1SBD  [7 pos Dip-Switch]

### Ports
BATT+ (out), BATT- (out), Cell Vias (harness Cells_Unfused), Cells (harness Cells), Cells Connector (harness Cells_Fused)

### Harnesses
Cells_Fused: Cell_Out_0, Cell_Out_1, Cell_Out_2, Cell_Out_3, Cell_Out_4, Cell_Out_5, Cell_Out_6, Cell_Out_7, Cell_Out_8, Cell_Out_9, Cell_Out_10, Cell_Out_11, Cell_Out_12
Cells_Unfused: Cell_Raw_0, Cell_Raw_1, Cell_Raw_2, Cell_Raw_3, Cell_Raw_4, Cell_Raw_5, Cell_Raw_6, Cell_Raw_7, Cell_Raw_8, Cell_Raw_9, Cell_Raw_10, Cell_Raw_11, Cell_Raw_12
Cells: Cell_12, Cell_11, Cell_10, Cell_9, Cell_8, Cell_7, Cell_6, Cell_5, Cell_4, Cell_3, Cell_2, Cell_1, Cell_0

### Nets
BATT+: SW100.7 ; port BATT+, port Cells.Cell_12
CF0: F112.2 SW101.14 ; port Cells Connector.Cell_Out_0
CF1: F111.2 SW101.13 ; port Cells Connector.Cell_Out_1
CF2: F110.2 SW101.12 ; port Cells Connector.Cell_Out_2
CF3: F109.2 SW101.11 ; port Cells Connector.Cell_Out_3
CF4: F108.2 SW101.10 ; port Cells Connector.Cell_Out_4
CF5: F107.2 SW101.9 ; port Cells Connector.Cell_Out_5
CF6: F106.2 SW100.14 SW101.8 ; port Cells Connector.Cell_Out_6
CF7: F105.2 SW100.13 ; port Cells Connector.Cell_Out_7
CF8: F104.2 SW100.12 ; port Cells Connector.Cell_Out_8
CF9: F103.2 SW100.11 ; port Cells Connector.Cell_Out_9
CF10: F102.2 SW100.10 ; port Cells Connector.Cell_Out_10
CF11: F101.2 SW100.9 ; port Cells Connector.Cell_Out_11
CF12: F100.2 SW100.8 ; port Cells Connector.Cell_Out_12
CN1: SW101.1 ; port BATT-, port Cells.Cell_0
CN2: SW101.2 ; port Cells.Cell_1
CN3: SW101.3 ; port Cells.Cell_2
CN4: SW101.4 ; port Cells.Cell_3
CN5: SW101.5 ; port Cells.Cell_4
CN6: SW101.6 ; port Cells.Cell_5
CN7: SW100.1 SW101.7 ; port Cells.Cell_6
CN8: SW100.2 ; port Cells.Cell_7
CN9: SW100.3 ; port Cells.Cell_8
CN10: SW100.4 ; port Cells.Cell_9
CN11: SW100.5 ; port Cells.Cell_10
CN12: SW100.6 ; port Cells.Cell_11
NetB1_0: F112.1 ; port Cell Vias.Cell_Raw_0
NetB1_1: F111.1 ; port Cell Vias.Cell_Raw_1
NetB1_2: F110.1 ; port Cell Vias.Cell_Raw_2
NetB1_3: F109.1 ; port Cell Vias.Cell_Raw_3
NetB1_4: F108.1 ; port Cell Vias.Cell_Raw_4
NetB1_5: F107.1 ; port Cell Vias.Cell_Raw_5
NetB1_6: F106.1 ; port Cell Vias.Cell_Raw_6
NetB1_7: F105.1 ; port Cell Vias.Cell_Raw_7
NetB1_8: F104.1 ; port Cell Vias.Cell_Raw_8
NetB1_9: F103.1 ; port Cell Vias.Cell_Raw_9
NetB1_10: F102.1 ; port Cell Vias.Cell_Raw_10
NetB1_11: F101.1 ; port Cell Vias.Cell_Raw_11
NetB1_12: F100.1 ; port Cell Vias.Cell_Raw_12

### Library data of the parts
F100-F112 = SFP200F: as F300 on sheet BMS_BatteryStackMonitor
SW100 SW101 = Dip Switches: Dip Switch SPST 7 Position Surface Mount Slide (Standard) Actuator 25mA 24VDC

## Sheet BMS_CAN.SchDoc
size A
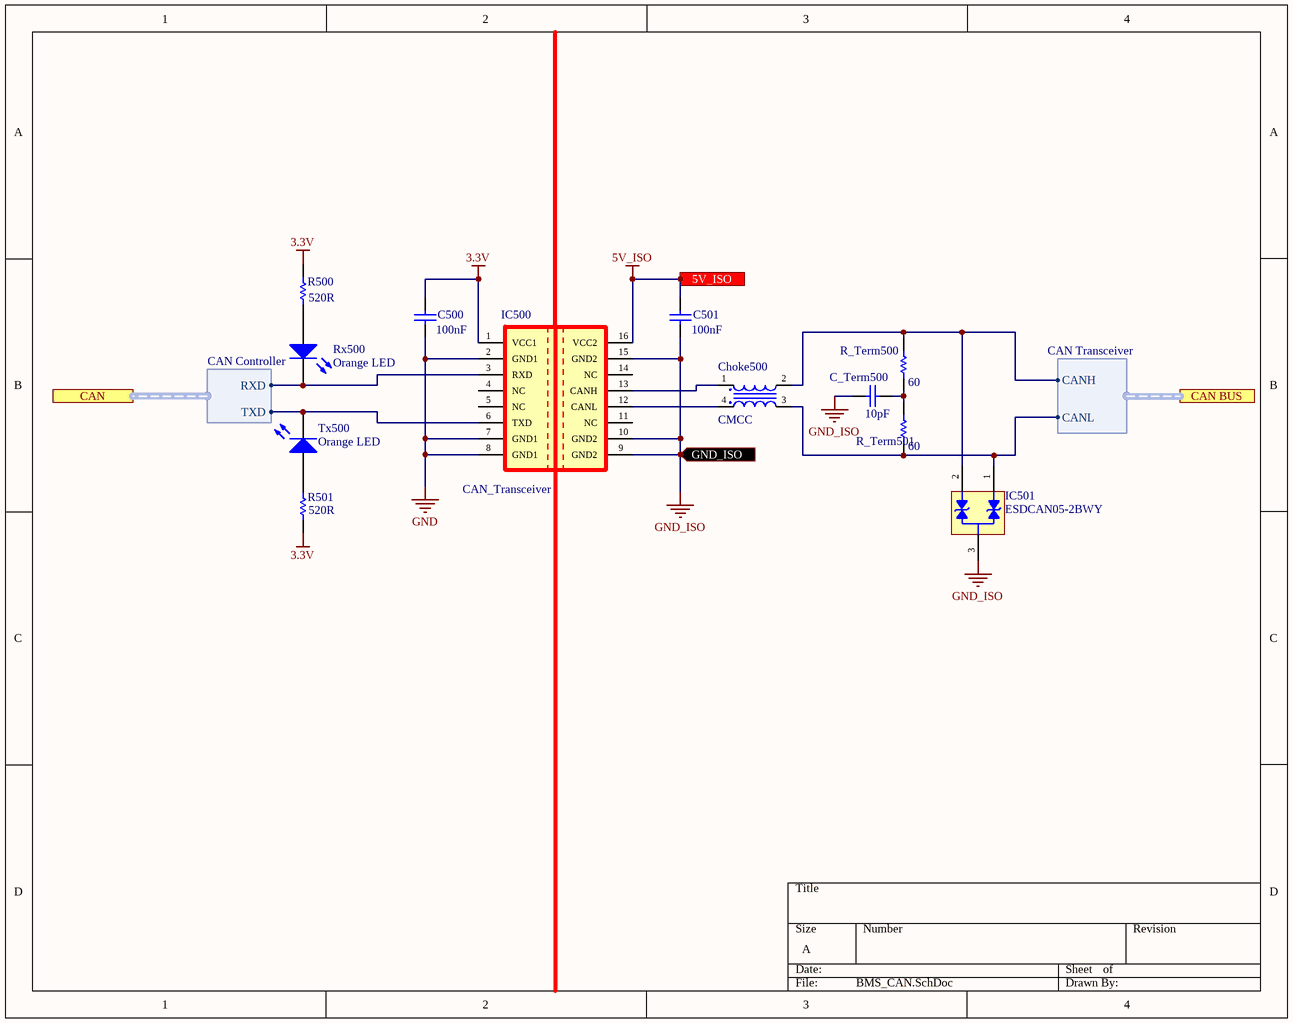
[diagram p6: BMS_CAN.SchDoc]

### Parts
C500  value 100nF  [CAPC2012X14N]  (hidden comment: Cap)
C501  value 100nF  [CAPC2012X14N]  (hidden comment: Cap)
C_Term500  value 10pF  [CAPC2012X14N]  (hidden comment: Cap)
Choke500  CMCC  [DLW32SH101XK2L]
IC500  CAN_Transceiver  [SOIC127P1030X265-16N]
IC501  ESDCAN05-2BWY  [SOT70P210X110-3N]
R500  value 520R  [RESC2012X07N]  (hidden comment: Res1)
R501  value 520R  [RESC2012X07N]  (hidden comment: Res1)
R_Term500  value 60  [RESC2012X07N]  (hidden comment: Res1)
R_Term501  value 60  [RESC2012X07N]  (hidden comment: Res1)
Rx500  Orange LED  [SMD ORANGE LED]
Tx500  Orange LED  [SMD ORANGE LED]

### Ports
5V_ISO (in), CAN (harness CAN Controller), CAN BUS (harness CAN Transceiver), GND_ISO (in)

### Harnesses
CAN Controller: TXD, RXD
CAN Transceiver: CANH, CANL

### Nets
3.3V: C500.2 IC500.1(VCC1) R500.2 R501.2
5V_ISO: C501.2 IC500.16(VCC2) ; port 5V_ISO
GND: C500.1 IC500.2(GND1) IC500.7(GND1) IC500.8(GND1)
GND_ISO: C501.1 C_Term500.2 IC500.9(GND2) IC500.10(GND2) IC500.15(GND2) IC501.3 ; port GND_ISO
CAN1_Rx: IC500.3(RXD) Rx500.2(K) ; port CAN.RXD
CAN1_Tx: IC500.6(TXD) Tx500.2(K) ; port CAN.TXD
NetC_Term500_1: C_Term500.1 R_Term500.1 R_Term501.2
NetChoke500_1: Choke500.1 IC500.13(CANH)
NetChoke500_2: Choke500.2 IC501.2 R_Term500.2 ; port CAN BUS.CANH
NetChoke500_3: Choke500.3 IC501.1 R_Term501.1 ; port CAN BUS.CANL
NetChoke500_4: Choke500.4 IC500.12(CANL)
NetR500_1: R500.1 Rx500.1(A)
NetR501_1: R501.1 Tx500.1(A)

Not connected (* = marked no-connect by the designer): IC500 4(NC) 5(NC) 11(NC) 14(NC)

### Library data of the parts
C500 C501 C_Term500 = Cap: Capacitor; Published: 8-Jun-2000; LatestRevisionDate: 17-Jul-2002; LatestRevisionNote: Re-released for DXP Platform.; PackageReference: RAD-0.3; Publisher: Altium Limited; PackageDescription: Radial Cap, Thru-Hole; 2 Leads; 0.3 in Pin Spacing
Choke500 = DLW32SH101XK2L: Common Mode Chokes / Filters 1210 80VDC 100uH 150mA AEC-Q200
IC500 = ISO1050DWR: Digital Isolators Isolated 5V CAN Xcvr
IC501 = ESDCAN05-2BWY: Automotive dual-line TVS in SOT323-3L for CAN bus
R500 R501 R_Term500 R_Term501 = Res1: Resistor; Published: 8-Jun-2000; LatestRevisionDate: 17-Jul-2002; LatestRevisionNote: Re-released for DXP Platform.; PackageReference: AXIAL-0.3; Publisher: Altium Limited; PackageDescription: Axial Device, Thru-Hole; 2 Leads; 0.3 in Pin Spacing
Rx500 Tx500 = LED0: Typical INFRARED GaAs LED; Published: 8-Jun-2000; LatestRevisionDate: 08-Jul-2005; LatestRevisionNote: Mech Layer 1 removed.; PackageReference: LED-0; Publisher: Altium Limited; PackageDescription: LED; 2 Leads

## Sheet BMS_PowerManagement.SchDoc
size A
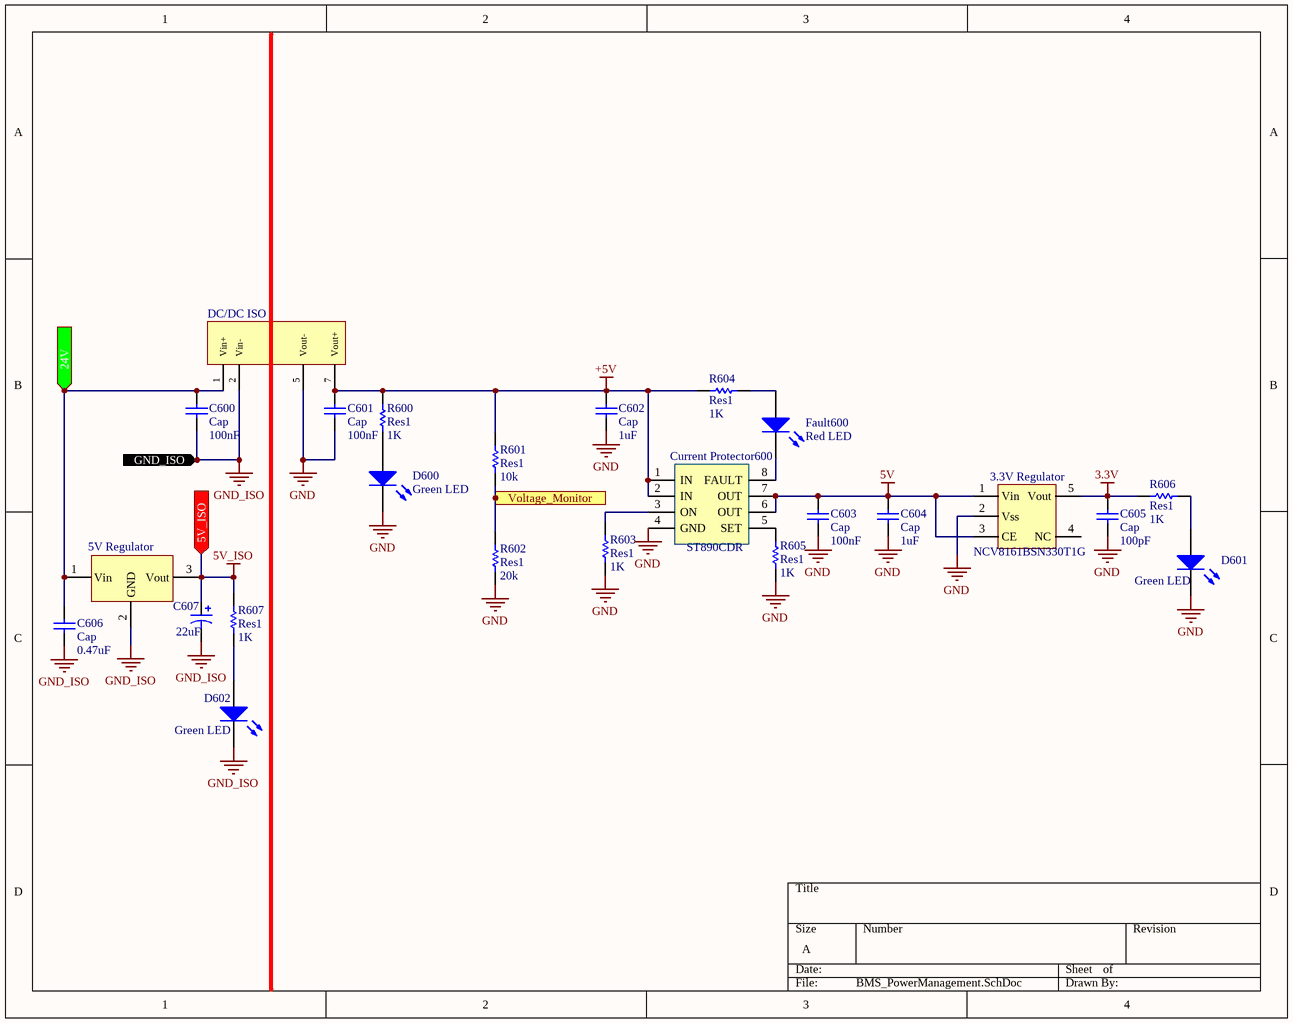
[diagram p7: BMS_PowerManagement.SchDoc]

### Parts
3.3V_Regulator  NCV8161BSN330T1G  [SOT95P280X110-5N]
5V_Regulator  LM2940IMPX-5.0/NOPB  [SOT230P700X180-4N]  (value not drawn)
C600  Cap  value 100nF  [CAPC2012X14N]
C601  Cap  value 100nF  [CAPC2012X14N]
C602  Cap  value 1uF  [CAPC2012X14N]
C603  Cap  value 100nF  [CAPC2012X14N]
C604  Cap  value 1uF  [CAPC2012X14N]
C605  Cap  value 100pF  [CAPC2012X14N]
C606  Cap  value 0.47uF  [CAPC2012X14N]
C607  value 22uF  [TPSA226K006T0300 Capacitor]  (hidden comment: Cap Pol1)
Current_Protector600  ST890CDR  [SOIC127P600X175-8N]
D600  Green LED  [SMD GREEN LED]
D601  Green LED  [SMD GREEN LED]
D602  Green LED  [SMD GREEN LED]
DC/DC_ISO  Isolated 5V DC/DC  [Isolated DC/DC]  (value not drawn)
Fault600  Red LED  [SMD RED LED]
R600  Res1  value 1K  [RESC2012X07N]
R601  Res1  value 10k  [RESC2012X07N]
R602  Res1  value 20k  [RESC2012X07N]
R603  Res1  value 1K  [RESC2012X07N]
R604  Res1  value 1K  [RESC2012X07N]
R605  Res1  value 1K  [RESC2012X07N]
R606  Res1  value 1K  [RESC2012X07N]
R607  Res1  value 1K  [RESC2012X07N]

### Ports
5V_ISO (in), 24V (in), GND_ISO (in), Voltage_Monitor (out)

### Nets
3.3V: 3.3V_Regulator.5(Vout) C605.1 R606.2
5V: 3.3V_Regulator.1(Vin) 3.3V_Regulator.3(CE) C603.1 C604.2 Current_Protector600.6(OUT) Current_Protector600.7(OUT)
5V_ISO: 5V_Regulator.3(Vout) C607.1 R607.2 ; port 5V_ISO
+5V: C601.1 C602.2 Current_Protector600.1(IN) Current_Protector600.2(IN) DC/DC_ISO.7(Vout+) R600.2 R601.2 R604.2
GND: 3.3V_Regulator.2(Vss) C601.2 C602.1 C603.2 C604.1 C605.2 Current_Protector600.4(GND) D600.2(K) D601.2(K) DC/DC_ISO.5(Vout-) R602.1 R603.1 R605.1
GND_ISO: 5V_Regulator.2(GND) C600.2 C606.2 C607.2 D602.2(K) DC/DC_ISO.2(Vin-) ; port GND_ISO
24V: 5V_Regulator.1(Vin) C600.1 C606.1 DC/DC_ISO.1(Vin+) ; port 24V
Voltage_Monitor: R601.1 R602.2 ; port Voltage_Monitor
NetCurrent_Protector600_3: Current_Protector600.3(ON) R603.2
NetCurrent_Protector600_5: Current_Protector600.5(SET) R605.2
NetCurrent_Protector600_8: Current_Protector600.8(FAULT) Fault600.2(K)
NetD600_1: D600.1(A) R600.1
NetD601_1: D601.1(A) R606.1
NetD602_1: D602.1(A) R607.1
NetFault600_1: Fault600.1(A) R604.1

Not connected (* = marked no-connect by the designer): 3.3V_Regulator 4(NC)

### Library data of the parts
3.3V_Regulator = NCV8161BSN330T1G: 450 mA, Ultra-Low Noise  and High PSRR LDO  Regulator for RF and  Analog Circuits
5V_Regulator = LM2940IMPX-5.0/NOPB: LM2940x 1-A Low Dropout Regulator
C600-C606 = Cap: Capacitor; Published: 8-Jun-2000; LatestRevisionDate: 17-Jul-2002; LatestRevisionNote: Re-released for DXP Platform.; PackageReference: RAD-0.3; Publisher: Altium Limited; PackageDescription: Radial Cap, Thru-Hole; 2 Leads; 0.3 in Pin Spacing
C607 = Cap Pol1: TPSA226K006T0300; Published: 8-Jun-2000; LatestRevisionDate: 17-Jul-2002; LatestRevisionNote: Re-released for DXP Platform.; PackageReference: RB7.6-15; Publisher: Altium Limited; PackageDescription: Polarized Capacitor (Radial); 2 Leads
Current_Protector600 = ST890CDR: 1.2A Current Limited High-Side Power Switch with Thermal Shutdown
D600-D602 Fault600 = LED0: Typical INFRARED GaAs LED; Published: 8-Jun-2000; LatestRevisionDate: 08-Jul-2005; LatestRevisionNote: Mech Layer 1 removed.; PackageReference: LED-0; Publisher: Altium Limited; PackageDescription: LED; 2 Leads
DC/DC_ISO = Isolated DC/DC: RKZE-0505S/H Isolated DC/DC Converters 2W 05Vin 5Vout 400mA Single SIP7
R600-R607 = Res1: Resistor; Published: 8-Jun-2000; LatestRevisionDate: 17-Jul-2002; LatestRevisionNote: Re-released for DXP Platform.; PackageReference: AXIAL-0.3; Publisher: Altium Limited; PackageDescription: Axial Device, Thru-Hole; 2 Leads; 0.3 in Pin Spacing

## Nets that join several sheets
3.3V: BMS_Main (H3.1), BMS_BatteryThermistors (5 pins), BMS_Microcontroller (15 pins), BMS_CAN (C500.2 IC500.1 R500.2 R501.2), BMS_PowerManagement (3.3V_Regulator.5 C605.1 R606.2)
5V: BMS_BatteryStackMonitor (10 pins), BMS_PowerManagement (6 pins)
5V_ISO: BMS_CAN (C501.2 IC500.16), BMS_PowerManagement (5V_Regulator.3 C607.1 R607.2)
BATT+: BMS_BatteryStackMonitor (L300.1 L301.1 R300.1), BMS_SafetyCircuit (SW100.7)
GND: BMS_Main (H3.6), BMS_BatteryStackMonitor (16 pins), U_BMS_BatteryStackMonitor/CELL1 (C200_CELL1.2), U_BMS_BatteryStackMonitor/CELL2 (C200_CELL2.2), U_BMS_BatteryStackMonitor/CELL3 (C200_CELL3.2), U_BMS_BatteryStackMonitor/CELL4 (C200_CELL4.2), U_BMS_BatteryStackMonitor/CELL5 (C200_CELL5.2), U_BMS_BatteryStackMonitor/CELL6 (C200_CELL6.2), U_BMS_BatteryStackMonitor/CELL7 (C200_CELL7.2), U_BMS_BatteryStackMonitor/CELL8 (C200_CELL8.2), U_BMS_BatteryStackMonitor/CELL9 (C200_CELL9.2), U_BMS_BatteryStackMonitor/CELL10 (C200_CELL10.2), U_BMS_BatteryStackMonitor/CELL11 (C200_CELL11.2), U_BMS_BatteryStackMonitor/CELL12 (C200_CELL12.2), BMS_BatteryThermistors (5 pins), BMS_Microcontroller (17 pins), BMS_CAN (C500.1 IC500.2 IC500.7 IC500.8), BMS_PowerManagement (13 pins)
GND_ISO: BMS_Main (H1.2 H2.2), BMS_CAN (6 pins), BMS_PowerManagement (6 pins)
24V: BMS_Main (H1.1 H2.1), BMS_PowerManagement (5V_Regulator.1 C600.1 C606.1 DC/DC_ISO.1)
Batt_Therm_1: BMS_BatteryThermistors (R700.1 T_1.2), BMS_Microcontroller (MCU400.14)
Batt_Therm_2: BMS_BatteryThermistors (R701.1 T_2.1), BMS_Microcontroller (MCU400.15)
Batt_Therm_3: BMS_BatteryThermistors (R702.1 T_3.2), BMS_Microcontroller (MCU400.16)
Batt_Therm_4: BMS_BatteryThermistors (R703.1 T_4.1), BMS_Microcontroller (MCU400.17)
Batt_Therm_5: BMS_BatteryThermistors (R704.1 T_5.1), BMS_Microcontroller (MCU400.20)
C0: BMS_BatteryStackMonitor (U300.26), U_BMS_BatteryStackMonitor/CELL1 (C201_CELL1.2 D201_CELL1.1)
C1: BMS_BatteryStackMonitor (U300.24), U_BMS_BatteryStackMonitor/CELL1 (C200_CELL1.1 C201_CELL1.1 D201_CELL1.2 R203_CELL1.1), U_BMS_BatteryStackMonitor/CELL2 (C201_CELL2.2 D201_CELL2.1)
C2: BMS_BatteryStackMonitor (U300.22), U_BMS_BatteryStackMonitor/CELL2 (C200_CELL2.1 C201_CELL2.1 D201_CELL2.2 R203_CELL2.1), U_BMS_BatteryStackMonitor/CELL3 (C201_CELL3.2 D201_CELL3.1)
C3: BMS_BatteryStackMonitor (U300.20), U_BMS_BatteryStackMonitor/CELL3 (C200_CELL3.1 C201_CELL3.1 D201_CELL3.2 R203_CELL3.1), U_BMS_BatteryStackMonitor/CELL4 (C201_CELL4.2 D201_CELL4.1)
C4: BMS_BatteryStackMonitor (U300.18), U_BMS_BatteryStackMonitor/CELL4 (C200_CELL4.1 C201_CELL4.1 D201_CELL4.2 R203_CELL4.1), U_BMS_BatteryStackMonitor/CELL5 (C201_CELL5.2 D201_CELL5.1)
C5: BMS_BatteryStackMonitor (U300.16), U_BMS_BatteryStackMonitor/CELL5 (C200_CELL5.1 C201_CELL5.1 D201_CELL5.2 R203_CELL5.1), U_BMS_BatteryStackMonitor/CELL6 (C201_CELL6.2 D201_CELL6.1)
C6: BMS_BatteryStackMonitor (U300.14), U_BMS_BatteryStackMonitor/CELL6 (C200_CELL6.1 C201_CELL6.1 D201_CELL6.2 R203_CELL6.1), U_BMS_BatteryStackMonitor/CELL7 (C201_CELL7.2 D201_CELL7.1)
C7: BMS_BatteryStackMonitor (U300.12), U_BMS_BatteryStackMonitor/CELL7 (C200_CELL7.1 C201_CELL7.1 D201_CELL7.2 R203_CELL7.1), U_BMS_BatteryStackMonitor/CELL8 (C201_CELL8.2 D201_CELL8.1)
C8: BMS_BatteryStackMonitor (U300.10), U_BMS_BatteryStackMonitor/CELL8 (C200_CELL8.1 C201_CELL8.1 D201_CELL8.2 R203_CELL8.1), U_BMS_BatteryStackMonitor/CELL9 (C201_CELL9.2 D201_CELL9.1)
C9: BMS_BatteryStackMonitor (U300.8), U_BMS_BatteryStackMonitor/CELL9 (C200_CELL9.1 C201_CELL9.1 D201_CELL9.2 R203_CELL9.1), U_BMS_BatteryStackMonitor/CELL10 (C201_CELL10.2 D201_CELL10.1)
C10: BMS_BatteryStackMonitor (U300.6), U_BMS_BatteryStackMonitor/CELL10 (C200_CELL10.1 C201_CELL10.1 D201_CELL10.2 R203_CELL10.1), U_BMS_BatteryStackMonitor/CELL11 (C201_CELL11.2 D201_CELL11.1)
C11: BMS_BatteryStackMonitor (U300.4), U_BMS_BatteryStackMonitor/CELL11 (C200_CELL11.1 C201_CELL11.1 D201_CELL11.2 R203_CELL11.1), U_BMS_BatteryStackMonitor/CELL12 (C201_CELL12.2 D201_CELL12.1)
C12: BMS_BatteryStackMonitor (U300.2), U_BMS_BatteryStackMonitor/CELL12 (C200_CELL12.1 C201_CELL12.1 D201_CELL12.2 R203_CELL12.1)
CAN1_Rx: BMS_Microcontroller (MCU400.44), BMS_CAN (IC500.3 Rx500.2)
CAN1_Tx: BMS_Microcontroller (MCU400.45), BMS_CAN (IC500.6 Tx500.2)
CF0: BMS_Main (H4.1), BMS_SafetyCircuit (F112.2 SW101.14)
CF1: BMS_Main (H4.2), BMS_SafetyCircuit (F111.2 SW101.13)
CF2: BMS_Main (H4.3), BMS_SafetyCircuit (F110.2 SW101.12)
CF3: BMS_Main (H4.4), BMS_SafetyCircuit (F109.2 SW101.11)
CF4: BMS_Main (H4.5), BMS_SafetyCircuit (F108.2 SW101.10)
CF5: BMS_Main (H4.6), BMS_SafetyCircuit (F107.2 SW101.9)
CF6: BMS_Main (H4.7 H4.8), BMS_SafetyCircuit (F106.2 SW100.14 SW101.8)
CF7: BMS_Main (H4.9), BMS_SafetyCircuit (F105.2 SW100.13)
CF8: BMS_Main (H4.10), BMS_SafetyCircuit (F104.2 SW100.12)
CF9: BMS_Main (H4.11), BMS_SafetyCircuit (F103.2 SW100.11)
CF10: BMS_Main (H4.12), BMS_SafetyCircuit (F102.2 SW100.10)
CF11: BMS_Main (H4.13), BMS_SafetyCircuit (F101.2 SW100.9)
CF12: BMS_Main (H4.14), BMS_SafetyCircuit (F100.2 SW100.8)
CN1: BMS_BatteryStackMonitor (D300.1 L302.1), U_BMS_BatteryStackMonitor/CELL1 (L200_CELL1.1), BMS_SafetyCircuit (SW101.1)
CN2: BMS_BatteryStackMonitor (D300.2), U_BMS_BatteryStackMonitor/CELL1 (Q200_CELL1.2 R202_CELL1.2 R203_CELL1.2), U_BMS_BatteryStackMonitor/CELL2 (L200_CELL2.1), BMS_SafetyCircuit (SW101.2)
CN3: U_BMS_BatteryStackMonitor/CELL2 (Q200_CELL2.2 R202_CELL2.2 R203_CELL2.2), U_BMS_BatteryStackMonitor/CELL3 (L200_CELL3.1), BMS_SafetyCircuit (SW101.3)
CN4: U_BMS_BatteryStackMonitor/CELL3 (Q200_CELL3.2 R202_CELL3.2 R203_CELL3.2), U_BMS_BatteryStackMonitor/CELL4 (L200_CELL4.1), BMS_SafetyCircuit (SW101.4)
CN5: U_BMS_BatteryStackMonitor/CELL4 (Q200_CELL4.2 R202_CELL4.2 R203_CELL4.2), U_BMS_BatteryStackMonitor/CELL5 (L200_CELL5.1), BMS_SafetyCircuit (SW101.5)
CN6: U_BMS_BatteryStackMonitor/CELL5 (Q200_CELL5.2 R202_CELL5.2 R203_CELL5.2), U_BMS_BatteryStackMonitor/CELL6 (L200_CELL6.1), BMS_SafetyCircuit (SW101.6)
CN7: U_BMS_BatteryStackMonitor/CELL6 (Q200_CELL6.2 R202_CELL6.2 R203_CELL6.2), U_BMS_BatteryStackMonitor/CELL7 (L200_CELL7.1), BMS_SafetyCircuit (SW100.1 SW101.7)
CN8: U_BMS_BatteryStackMonitor/CELL7 (Q200_CELL7.2 R202_CELL7.2 R203_CELL7.2), U_BMS_BatteryStackMonitor/CELL8 (L200_CELL8.1), BMS_SafetyCircuit (SW100.2)
CN9: U_BMS_BatteryStackMonitor/CELL8 (Q200_CELL8.2 R202_CELL8.2 R203_CELL8.2), U_BMS_BatteryStackMonitor/CELL9 (L200_CELL9.1), BMS_SafetyCircuit (SW100.3)
CN10: U_BMS_BatteryStackMonitor/CELL9 (Q200_CELL9.2 R202_CELL9.2 R203_CELL9.2), U_BMS_BatteryStackMonitor/CELL10 (L200_CELL10.1), BMS_SafetyCircuit (SW100.4)
CN11: U_BMS_BatteryStackMonitor/CELL10 (Q200_CELL10.2 R202_CELL10.2 R203_CELL10.2), U_BMS_BatteryStackMonitor/CELL11 (L200_CELL11.1), BMS_SafetyCircuit (SW100.5)
CN12: U_BMS_BatteryStackMonitor/CELL11 (Q200_CELL11.2 R202_CELL11.2 R203_CELL11.2), U_BMS_BatteryStackMonitor/CELL12 (L200_CELL12.1), BMS_SafetyCircuit (SW100.6)
CP12: BMS_BatteryStackMonitor (L300.2), U_BMS_BatteryStackMonitor/CELL12 (Q200_CELL12.2 R202_CELL12.2 R203_CELL12.2)
NetB1_0: BMS_Main (B1.0), BMS_SafetyCircuit (F112.1)
NetB1_1: BMS_Main (B1.1), BMS_SafetyCircuit (F111.1)
NetB1_2: BMS_Main (B1.2), BMS_SafetyCircuit (F110.1)
NetB1_3: BMS_Main (B1.3), BMS_SafetyCircuit (F109.1)
NetB1_4: BMS_Main (B1.4), BMS_SafetyCircuit (F108.1)
NetB1_5: BMS_Main (B1.5), BMS_SafetyCircuit (F107.1)
NetB1_6: BMS_Main (B1.6), BMS_SafetyCircuit (F106.1)
NetB1_7: BMS_Main (B1.7), BMS_SafetyCircuit (F105.1)
NetB1_8: BMS_Main (B1.8), BMS_SafetyCircuit (F104.1)
NetB1_9: BMS_Main (B1.9), BMS_SafetyCircuit (F103.1)
NetB1_10: BMS_Main (B1.10), BMS_SafetyCircuit (F102.1)
NetB1_11: BMS_Main (B1.11), BMS_SafetyCircuit (F101.1)
NetB1_12: BMS_Main (B1.12), BMS_SafetyCircuit (F100.1)
NetChoke500_2: BMS_Main (H1.4 H2.4), BMS_CAN (Choke500.2 IC501.2 R_Term500.2)
NetChoke500_3: BMS_Main (H1.3 H2.3), BMS_CAN (Choke500.3 IC501.1 R_Term501.1)
RESET: BMS_Main (H3.3), BMS_Microcontroller (C407.1 MCU400.7 R400.1 Tactile_Switch400.1)
S1: BMS_BatteryStackMonitor (U300.25), U_BMS_BatteryStackMonitor/CELL1 (R204_CELL1.1)
S2: BMS_BatteryStackMonitor (U300.23), U_BMS_BatteryStackMonitor/CELL2 (R204_CELL2.1)
S3: BMS_BatteryStackMonitor (U300.21), U_BMS_BatteryStackMonitor/CELL3 (R204_CELL3.1)
S4: BMS_BatteryStackMonitor (U300.19), U_BMS_BatteryStackMonitor/CELL4 (R204_CELL4.1)
S5: BMS_BatteryStackMonitor (U300.17), U_BMS_BatteryStackMonitor/CELL5 (R204_CELL5.1)
S6: BMS_BatteryStackMonitor (U300.15), U_BMS_BatteryStackMonitor/CELL6 (R204_CELL6.1)
S7: BMS_BatteryStackMonitor (U300.13), U_BMS_BatteryStackMonitor/CELL7 (R204_CELL7.1)
S8: BMS_BatteryStackMonitor (U300.11), U_BMS_BatteryStackMonitor/CELL8 (R204_CELL8.1)
S9: BMS_BatteryStackMonitor (U300.9), U_BMS_BatteryStackMonitor/CELL9 (R204_CELL9.1)
S10: BMS_BatteryStackMonitor (U300.7), U_BMS_BatteryStackMonitor/CELL10 (R204_CELL10.1)
S11: BMS_BatteryStackMonitor (U300.5), U_BMS_BatteryStackMonitor/CELL11 (R204_CELL11.1)
S12: BMS_BatteryStackMonitor (U300.3), U_BMS_BatteryStackMonitor/CELL12 (R204_CELL12.1)
SPI1_CS: BMS_BatteryStackMonitor (U300.41), BMS_Microcontroller (MCU400.24)
SPI1_MISO: BMS_BatteryStackMonitor (U300.44), BMS_Microcontroller (MCU400.22)
SPI1_MOSI: BMS_BatteryStackMonitor (U300.43), BMS_Microcontroller (MCU400.23)
SPI1_SCK: BMS_BatteryStackMonitor (U300.42), BMS_Microcontroller (MCU400.21)
SWCLK: BMS_Main (H3.5), BMS_Microcontroller (MCU400.49)
SWDIO: BMS_Main (H3.2), BMS_Microcontroller (MCU400.46)
SWO: BMS_Main (H3.4), BMS_Microcontroller (MCU400.55)
Voltage_Monitor: BMS_Microcontroller (MCU400.39), BMS_PowerManagement (R601.1 R602.2)
Α0: BMS_BatteryStackMonitor (SC307.1 SC308.1 U300.45), BMS_Microcontroller (MCU400.11)
Α1: BMS_BatteryStackMonitor (SC305.1 SC306.1 U300.46), BMS_Microcontroller (MCU400.10)
Α2: BMS_BatteryStackMonitor (SC303.1 SC304.1 U300.47), BMS_Microcontroller (MCU400.9)
Α3: BMS_BatteryStackMonitor (SC300.1 SC301.1 U300.48), BMS_Microcontroller (MCU400.8)